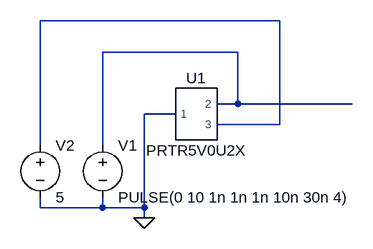
[diagram p0: schematic Draft1.asc]
Draft1.asc, the LTspice schematic file:
Version 4
SHEET 1 880 680
WIRE 368 0 0 0
WIRE 304 48 96 48
WIRE 304 128 304 48
WIRE 304 128 272 128
WIRE 480 128 304 128
WIRE 208 144 160 144
WIRE 368 160 368 0
WIRE 368 160 272 160
WIRE 0 192 0 0
WIRE 96 192 96 48
WIRE 0 288 0 272
WIRE 96 288 96 272
WIRE 96 288 0 288
WIRE 160 288 160 144
WIRE 160 288 96 288
WIRE 160 304 160 288
FLAG 160 304 0
SYMBOL PRTR5V0U2X 240 144 R0
SYMATTR InstName U1
SYMBOL voltage 96 176 R0
WINDOW 123 0 0 Left 0
WINDOW 39 0 0 Left 0
SYMATTR InstName V1
SYMATTR Value PULSE(0 10 1n 1n 1n 10n 30n 4)
SYMBOL voltage 0 176 R0
SYMATTR InstName V2
SYMATTR Value 5

The netlist it stands for:
* Draft1.asc
XU1 0 N002 N001 PRTR5V0U2X  ; pins 1 2 3
V1 N002 0 PULSE(0 10 1n 1n 1n 10n 30n 4)
V2 N001 0 5
.lib C:\Jeonghyun\GIT\RFSoC_FrontEnd\Simulation\SpartanSim\ESD\PRTR5V0U2X.lib
.backanno
.end